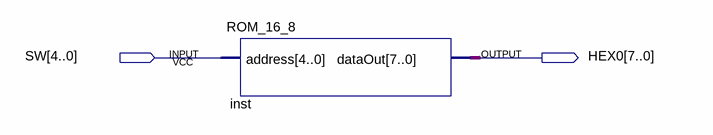
[diagram p0: schematic sheet]
// Quartus schematic ROM_DEMO.bdf as structural Verilog: 1 symbols, 2 pins
module ROM_DEMO (
  input  [4:0] SW,
  output [7:0] HEX0
);

  ROM_16_8 inst (.address(SW), .dataOut(HEX0));
endmodule
